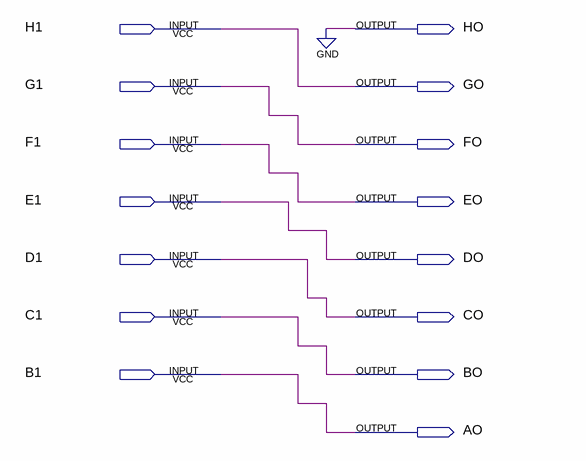
[diagram p0: schematic sheet]
// Quartus schematic ShiftLeft.bdf as structural Verilog: 0 symbols, 15 pins
module ShiftLeft (
  input  H1,
  input  G1,
  input  F1,
  input  E1,
  input  D1,
  input  C1,
  input  B1,
  output HO,
  output GO,
  output FO,
  output EO,
  output DO,
  output CO,
  output BO,
  output AO
);


  assign AO = B1;
  assign BO = C1;
  assign CO = D1;
  assign DO = E1;
  assign EO = F1;
  assign FO = G1;
  assign GO = H1;
  assign HO = 1'b0;
endmodule
